# EAGLE design esp8266-board (EAGLE 7.2.0)
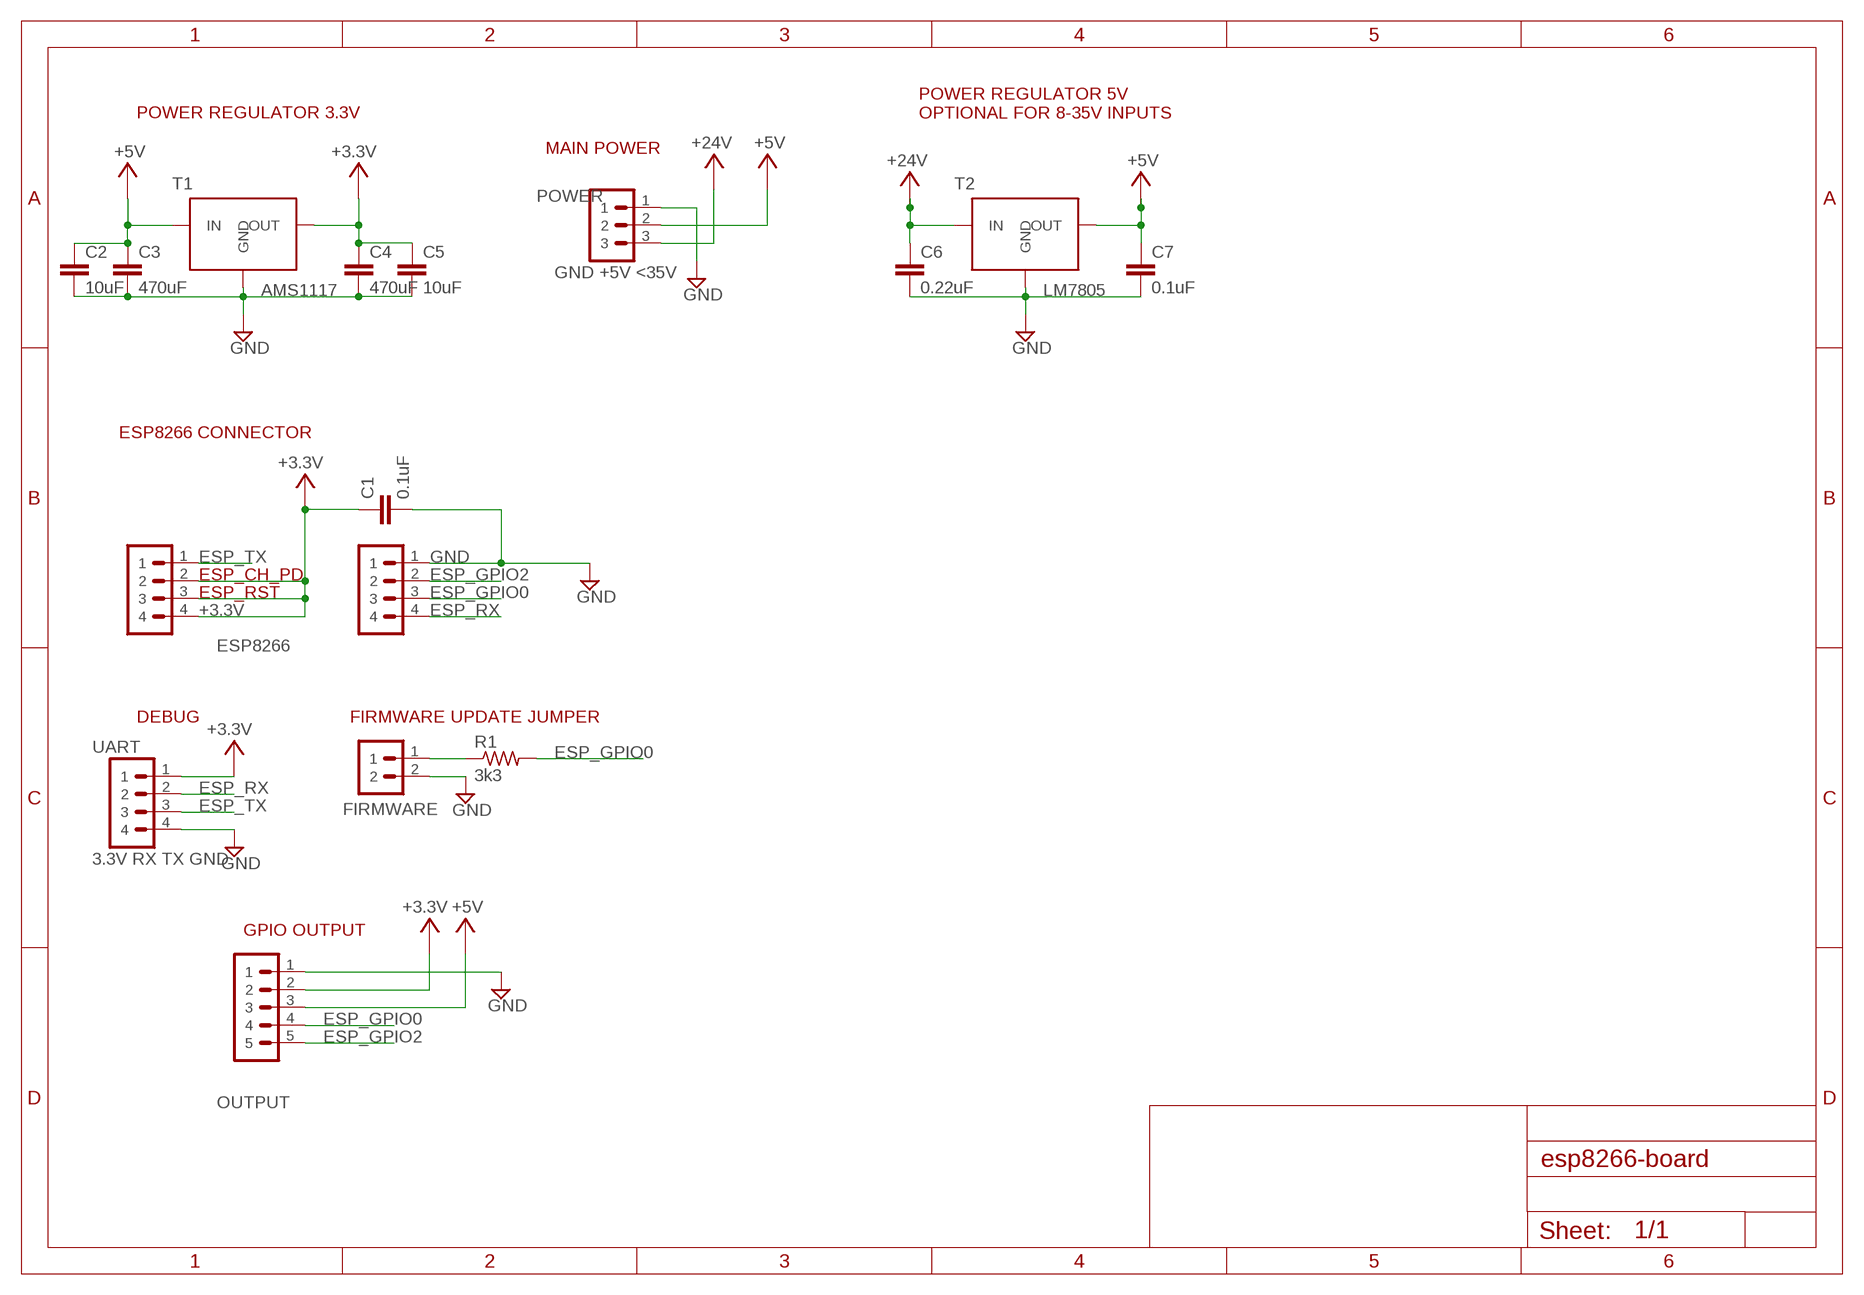
[diagram p0: schematic, sheet 1]

## Parts
C1  0.1uF  C2.5/2  [C2.5-2]
C2  10uF  C2.5/2  [C2.5-2]
C3  470uF  C2.5/2  [C2.5-2]
C4  470uF  C2.5/2  [C2.5-2]
C5  10uF  C2.5/2  [C2.5-2]
C6  0.22uF  C2.5/2  [C2.5-2]
C7  0.1uF  C2.5/2  [C2.5-2]
FIRMWARE  FIRMWARE  PIN-HEADER-2PIN  [PIN-HEADER-2PIN]
OUTPUT  GND 3.3V 5V IO0 IO2  PIN-HEADER-5PIN  [PIN-HEADER-5PIN]
P1  ESP8266  PIN-HEADER-4PIN  [PIN-HEADER-4PIN]
P2  ESP8266 CONNECTOR  PIN-HEADER-4PIN  [PIN-HEADER-4PIN]
POWER  GND +5V <35V  PIN-HEADER-3PIN  [PIN-HEADER-3PIN]
R1  3k3  RESISTORV2  [RESISTOR-V2]
T1  AMS1117  [SOT-223]
T2  LM7805  [TO-220]
UART  3.3V RX TX GND  PIN-HEADER-4PIN  [PIN-HEADER-4PIN]

## Nets
+3.3V [power-2A]: C1.1 C4.1 C5.1 OUTPUT.2 P1.2 P1.3 P1.4 T1.2(OUT) UART.1
+5V [power-2A]: C2.1 C3.1 C7.1 OUTPUT.3 POWER.2 T1.3(IN) T2.OUTPUT(OUT)
+24V [power-2A]: C6.1 POWER.3 T2.INPUT(IN)
ESP_GPIO0: OUTPUT.4 P2.3 R1.2
ESP_GPIO2: OUTPUT.5 P2.2
ESP_RX: P2.4 UART.2
ESP_TX: P1.1 UART.3
GND [power-2A]: C1.2 C2.2 C3.2 C4.2 C5.2 C6.2 C7.2 FIRMWARE.2 OUTPUT.1 P2.1 POWER.1 T1.1(GND) T2.GND UART.4
N$1: FIRMWARE.1 R1.1

## Notes on the sheet
- POWER REGULATOR 3.3V
- POWER REGULATOR 5V
  OPTIONAL FOR 8-35V INPUTS
- MAIN POWER
- ESP8266 CONNECTOR
- ESP_CH_PD
- ESP_RST
- DEBUG | FIRMWARE UPDATE JUMPER
- GPIO OUTPUT

## Library data of the parts
C1 C2 C5 = capacitor-wima:C: CAPACITOR naming: grid - package width
C3 C6 = capacitor-wima:C: CAPACITOR naming: grid - package width; MPN: 1C10Z5U104M050B
C4 C7 = capacitor-wima:C: CAPACITOR naming: grid - package width; MPN: FK18X5R0J106M
FIRMWARE = stutz-eagle:PIN-HEADER-2PIN
OUTPUT = stutz-eagle:PIN-HEADER-5PIN
P1 P2 UART = stutz-eagle:PIN-HEADER-4PIN
POWER = stutz-eagle:PIN-HEADER-3PIN
R1 = stutz-eagle:RESISTOR
T1 = stutz-eagle:AMS1117; MPN: LM2937ET-3.3
T2 = stutz-eagle:LM7805; MPN: LM2937ET-3.3

## Net classes
0 default: clearance 0.355 mm
1 power-4A: width 2.642 mm
2 comm-rs485: width 1.016 mm
3 power-2A: width 1.143 mm

## Board
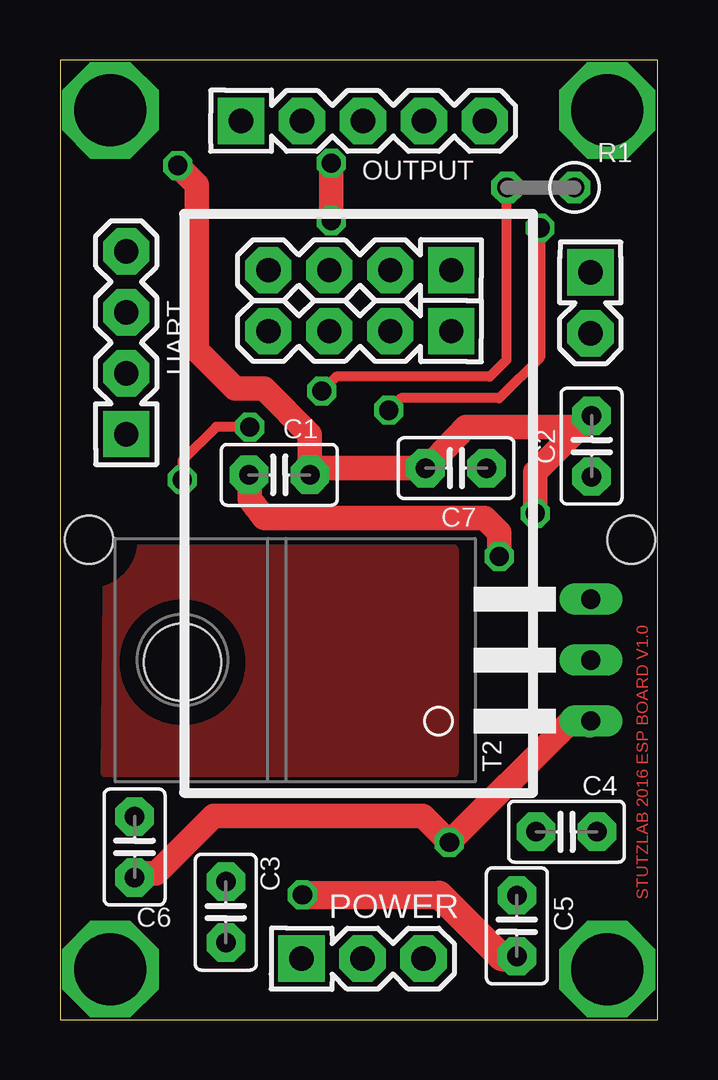
[diagram p1: board, top side]
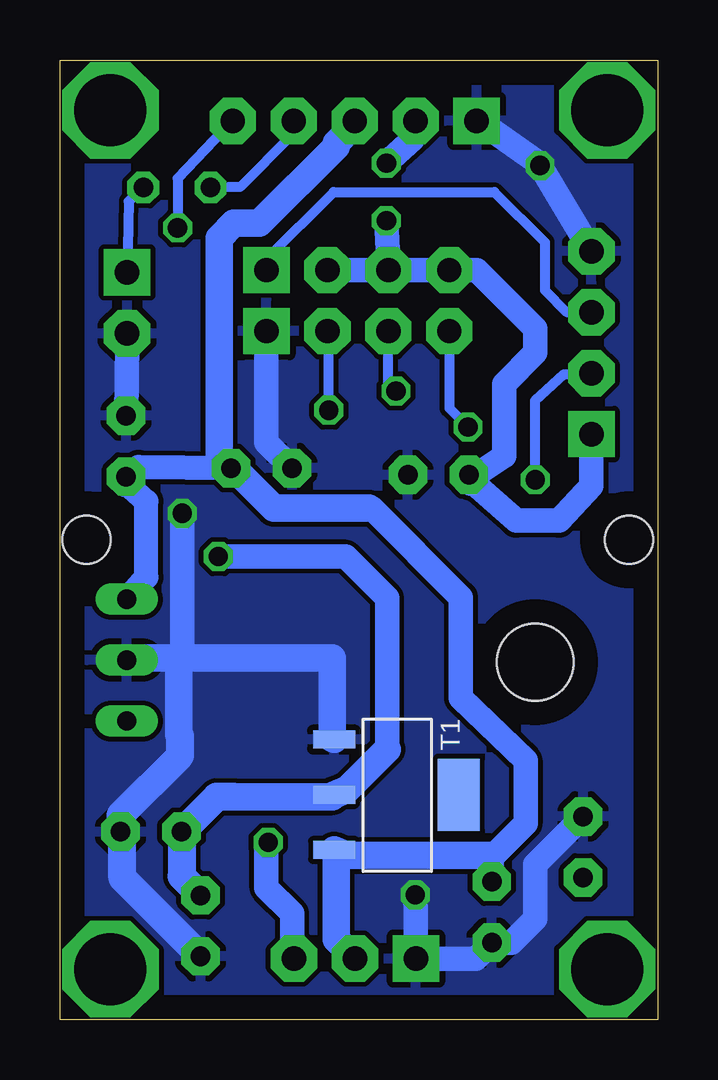
[diagram p2: board, bottom side, seen from below]

Size 24.9 x 40 mm. Coordinates in mm from the lower left corner, seen from the top.
Outline: 0,0 24.9,0 24.9,40 0,40 0,0
Copper layers (1*16): Top 0.035mm / dielectric 1.5mm / Bottom 0.035mm
Design rules "default": minimum track width 10mil, minimum drill 0.6mm, track to track 8mil, track to pad 8mil, pad to pad 8mil, via to via 8mil, smd to smd 8mil, copper to edge 40mil, drill to drill 8mil, minimum pad ring 10mil, minimum via ring 8mil, stop-mask expansion 4mil, vias tented up to drill 0mil, thermal gap 10mil
Holes 3.2 mm at 5.1,14.9
Holes 2 mm at 23.8,20 1.2,20

### Footprints (pad centres in the part's own frame; a part is rotated, then mirrored left to right if it is on the bottom)
C2.5-2 = drill 0.813 pad 1.6 octagon: 1 -1.27,0; 2 1.27,0
PIN-HEADER-2PIN = drill 1.016 pad 1.93 square: 1 -1.27,0 | drill 1.016 pad 1.93 octagon: 2 1.27,0
PIN-HEADER-5PIN = drill 1.016 pad 1.93 square: 1 -5.08,0 | drill 1.016 pad 1.93 octagon: 2 -2.54,0; 3 0,0; 4 2.54,0; 5 5.08,0
PIN-HEADER-4PIN = drill 1.016 pad 1.93 square: 1 -3.81,0 | drill 1.016 pad 1.93 octagon: 2 -1.27,0; 3 1.27,0; 4 3.81,0
PIN-HEADER-3PIN = drill 1.016 pad 1.93 square: 1 -2.54,0 | drill 1.016 pad 1.93 octagon: 2 0,0; 3 2.54,0
RESISTOR-V2 = drill 0.813 octagon: 1 -1.524,0; 2 1.27,0
SOT-223 = smd 0.75 x 1.75: 1 -2.3,-2.6; 2 0,-2.6; 3 2.3,-2.6 | smd 3 x 1.75: 4 0,2.6
TO-220 = drill 0.8 long: GND 0,-8.89; INPUT -2.54,-8.89; OUTPUT 2.54,-8.89

### Placement (x,y rotation side)
C1  9.14,22.71 0 top
C2  22.15,23.9 90 top
C3  6.91,4.47 270 top
C4  21.1,7.83 0 top
C5  19.04,3.91 270 top
C6  3.11,7.19 90 top
C7  16.5,22.98 180 top
FIRMWARE  22.1,29.87 270 top
OUTPUT  12.62,37.46 0 top
P1  12.49,31.24 180 top
P2  12.49,28.7 180 top
POWER  12.61,2.54 0 top
R1  19.91,34.68 180 top
T1  10.88,9.37 270 bottom
T2  13.23,14.98 90 top
UART  2.76,28.21 90 top

### Tracks (layer width: path | path; a pad name or v marks a point on that pad's centre or on a via)
+3.3V  (via drill 0.8)
  Top 1.016: v11.3,35.7 v11.3,33.3 | v18.3,19.3 18.3,20.3 17.7,20.9 8.5,20.9 7.9,21.7 7.9,22.57 C1.1
  Bottom 1.016: 10.08,37.52 OUTPUT.2 10.2,37.34 10.2,36.7 v11.3,35.7 | v11.3,33.3 11.2,31.26 P1.3 | P1.3 P1.2 | P1.3 P1.4 7.54,31.24 5.1,28.8 5.1,27.8 6.4,26.5 6.4,23.5 7.9,22.5 7.96,22.4 C1.1 7.8,22.34 7.8,22.5 5.9,20.8 4.1,20.8 2.76,22.24 UART.1 | 11.27,11.27 11.27,17.57 13,19.3 v18.3,19.3
  Bottom 1.143: 17.66,9.29 13.55,9.29 T1.2 12.94,9.59 11.27,11.27
  Bottom 1.16: 17.66,9.29 18.38,9.29 C4.1 19.83,5.97 C5.1
+5V
  Bottom 1: T2.OUTPUT 21.3,18.44 21.3,21.6 22.15,22.35
  Bottom 1.016: C2.1 21.62,23.03 C7.1 | C3.1 6.91,6.76 | 6.91,6.76 7,6.85 | 12.03,21.32 11.91,21.32 8.2,17.6 8.2,13.4 5.5,10.8 5.5,8.17 6.91,6.76
  Bottom 1.143: POWER.2 12.64,2.59 13.4,3.35 13.4,7 T1.3 12.94,6.85 7,6.85 | OUTPUT.3 12.79,37.15 13.4,36.54 13.4,36.39 16.59,33.19 17.66,33.19 18.27,32.58 18.27,23.45 17.81,22.99 C7.1 17.36,22.68 15.99,21.32 12.03,21.32
  Bottom 1.16: 22.15,22.35 C2.1
+24V  (via drill 0.8)
  Top 1.016: C6.1 3.28,6.1 4,6.1 6.4,8.5 15.11,8.5 v16.23,7.38 21.18,12.33 22.08,12.33
  Top 1.143: 22.08,12.33 T2.INPUT
  Bottom 1.016: POWER.3 15.22,2.62 15.22,4.42 16.3,5.5 16.3,7.31 v16.23,7.38
ESP_GPIO0  (via drill 0.8)
  Top 0.406: R1.2 18.6,33.96 18.6,27.5 17.9,26.8 11.5,26.8 v10.9,26.2
  Bottom 0.406: OUTPUT.4 15.26,36.84 17.4,34.7 17.86,34.7 R1.2 | v10.9,26.2 11.22,26.52 P2.3
ESP_GPIO2  (via drill 0.8)
  Top 0.406: v20,33 20,27.6 18.3,25.9 14.2,25.9 v13.7,25.4
  Bottom 0.406: OUTPUT.5 20,35.06 v20,33 | v13.7,25.4 13.7,28.64 P2.2
ESP_RX  (via drill 0.8)
  Top 0.406: v7.9,24.7 6.5,24.7 5.1,23.3 v5.1,22.5
  Bottom 0.406: P2.4 8.68,25.48 v7.9,24.7 | v5.1,22.5 5.1,25.8 3.9,26.9 3,26.9
  Bottom 1.016: 3,26.9 UART.2
ESP_TX
  Bottom 0.406: P1.1 16.3,31.7 13.5,34.5 6.8,34.5 4.7,32.4 4.7,30.4 3.8,29.5 2.98,29.5 UART.3
GND  (via drill 0.8)
  Top 1.016: C7.2 15.29,22.99 16.9,24.7 21.72,24.7 C2.2 19.8,22.83 v19.8,21.1 | 10.51,22.99 10.51,22.5 C1.2 | C1.2 10.41,24.39 8.5,26.3 7.3,26.3 5.7,27.9 5.7,34.8 v4.9,35.6 | 3.27,8.3 C6.2 | C7.2 10.98,22.98 C1.2
  Top 1.16: v10.1,5.2 15.8,5.2 18.4,2.6 19,2.6 C5.2
  Bottom 1.016: FIRMWARE.2 22.1,28.23 C2.2 | P2.1 16.3,24.05 C7.2 | UART.4 4.86,35.56 v4.9,35.6 5.1,35.8 7.5,37.5 OUTPUT.1 | C6.2 5.1,6.47 5.1,4.2 6.09,3.21 C3.2 7.58,2.54 POWER.1 10.07,4.37 v10.1,5.2 | v19.8,21.1 19.8,15.07
  Bottom 1.143: T1.1 13.55,11.72 13.55,15.07 19.8,15.07 19.95,15.07 | 19.95,15.07 22.08,15.07 T2.GND | 19.95,15.07 19.95,11.88
  Bottom 1.16: 19.95,11.88 19.9,11.83 19.9,11 22.37,8.53 C4.2 22.3,7.76 22.3,5.9 C5.2
  pour Bottom: -3.1,42 27,42 27.3,-1.4 -3.1,-1.3
N$1
  Bottom 0.406: R1.1 22.04,34.11 FIRMWARE.1
N$2  (via drill 3)
  other vias: 22.8,37.9
N$3  (via drill 3)
  other vias: 22.8,2.1
N$4  (via drill 3)
  other vias: 2.1,2.1
N$5  (via drill 3)
  other vias: 2.1,37.9
N$6
  pour Top: 2,19.6 16.4,19.6 16.4,10.3 1.9,10.3

### Text on the board
Top: STUTZLAB 2016 ESP BOARD V1.0
Notes: ESP8266 | FEMALE PIN | LM7805 | ESP8266 | LM7805 | SOLDERED